# Altium project Radiation_Uni_Board.PrjPcb (part 1 of 2)
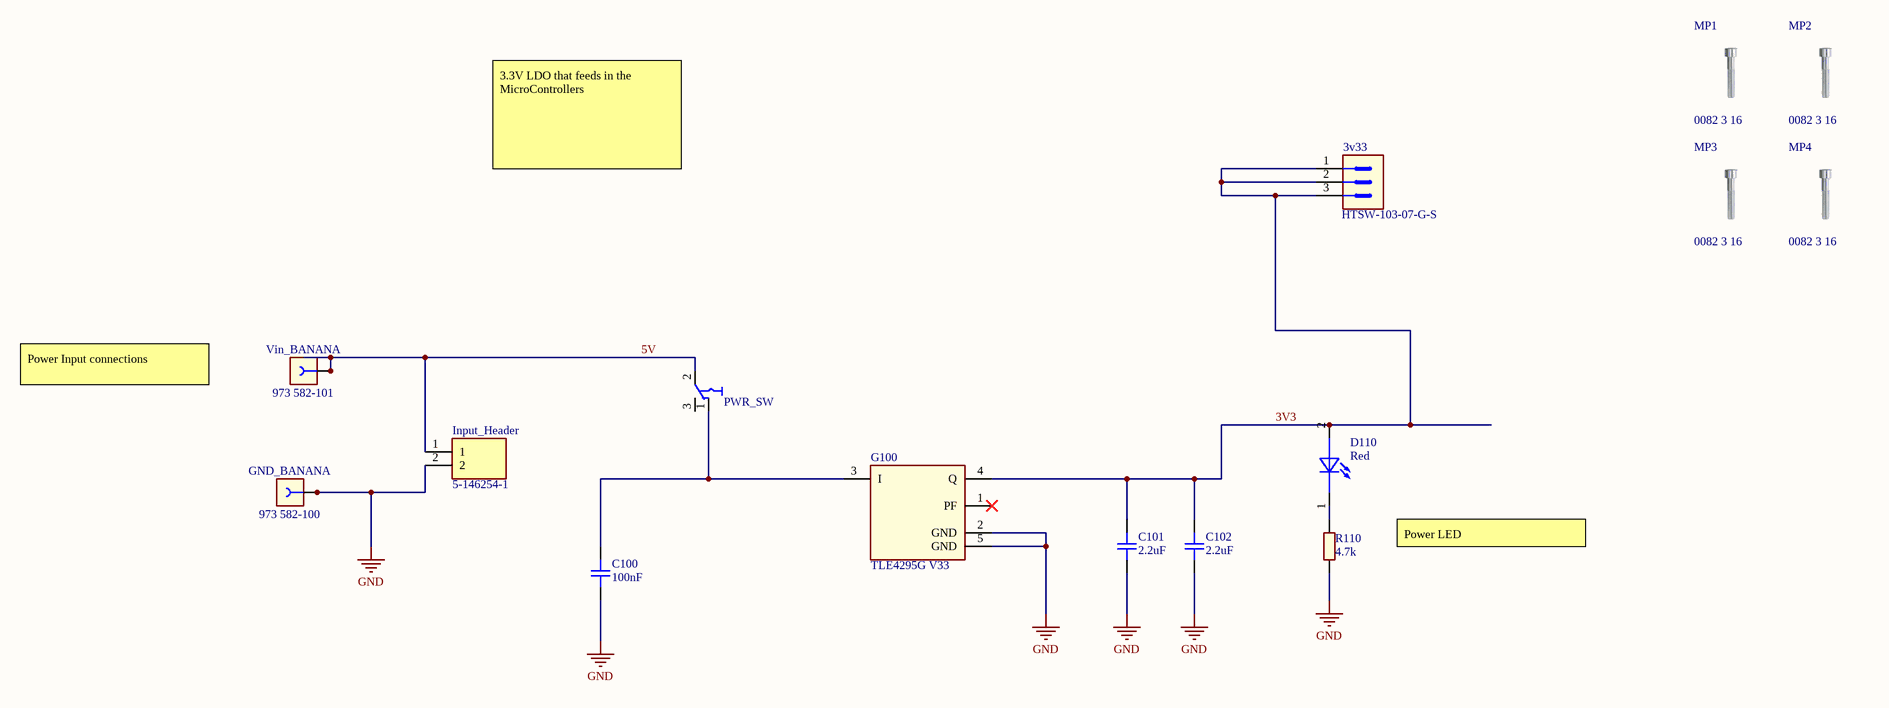
[diagram p0: PowerSupply.SchDoc]
PRJ_Address1: IFAG DES SDF SCS EPE; PRJ_Address2: Technical University of Munich; PRJ_Engineer: Youssef Tarkhan; PRJ_Organization: Infineon Technologies AG/TUM; PRJ_PCB_Revision: V1.0; PRJ_PCBDesigner: Youssef Tarkhan; PRJ_Responsible: Youssef Tarkhan; PRJ_SCH_Author: Youssef Tarkhan; PRJ_SCH_Revision: V1.0; PRJ_Title: MCU Radiation Testing Board; PRJ_Year: 2022; Variant: V1.0
3 sheets, 92 parts. Net scope: global (net labels, ports and power ports of the same name join across sheets).
Board file: Mainboard.PcbDoc
Sheets:
  PowerSupply.SchDoc
  STM32.SchDoc
  XMC4504.SchDoc

## Sheet PowerSupply.SchDoc: <Project Name>
size A3; ApprovedBy: <Appr.>; Author: <Author>; CompanyName: Infineon Technologies AG; Engineer: <Rel.>; Organization: Infineon Technologies AG; Address1: IFAG DES S PS; Address2: Am Campeon 1-12  -  85579 Neubiberg  -  Germany; Address3: 85579 Neubiberg; Address4: Germany; Revision: <Rev.>; SheetNumber: 1; SheetTotal: 3; Release: RC00; PageSetup: Record=PageOptions|CenterHorizontal=True|CenterVertical=True|PrintScale=1.01|XCorrection=1.00|YCorrection=1.00|PrintKind=0|BorderSize=5000000|LeftOffset=0|BottomOffset=0|Orientation=2|PaperLength=1000|PaperWidth=1000|Scale=100|PaperSource=7|PrintQuality=-4|MediaType=1|DitherType=10|PaperKind=A3|PrintScaleMode=1; Doc_ConfidentialStatus: <Doc_ConfidentialStatus>; Doc_Preliminary: <Doc_Preliminary>

### Parts
3v33  HTSW-103-07-G-S  [CON-THT-2.54-3-1-8.38]
C100  100nF  [CAPC1608X90N-2]
C101  2.2uF  [CAPC1608X90N-3]
C102  2.2uF  [CAPC1608X90N-3]
D110  Red  [LEDSC160X80X80-2N-1]
G100  TLE4295G V33  [IFX-PG-SCT595-5-2]
GND_BANANA  973 582-100  [CON-THT-973 582- 100]
Input_Header  5-146254-1  [HDRV2W68P254_2X1_213X488X1045P]
MP1  0082 3 16  [SCREW_0082 3 16_NPTH]
MP2  0082 3 16  [SCREW_0082 3 16_NPTH]
MP3  0082 3 16  [SCREW_0082 3 16_NPTH]
MP4  0082 3 16  [SCREW_0082 3 16_NPTH]
PWR_SW  CL-SB-12A-01T  [SW-SMD-CL-SB-12A-01T]  (value not drawn)
R110  4.7k  [RESC1609X55N]
Vin_BANANA  973 582-101  [CON-THT-973 582- 101]

### Nets
3V3: 3v33.1 3v33.2 3v33.3 C101.2 C102.2 D110.2(Anode) G100.4(Q)
GND: C100.1 C101.1 C102.1 G100.2(GND) G100.5(GND) GND_BANANA.1 GND_BANANA.2 Input_Header.2 R110.1  [project net VAGND]
5V: Input_Header.1 PWR_SW.2 Vin_BANANA.1 Vin_BANANA.2
NetC100_2: C100.2 G100.3(I) PWR_SW.1
NetD110_1: D110.1(Cathode) R110.2

Not connected (* = marked no-connect by the designer): G100 1(PF)*; PWR_SW 3

### Notes on the sheet
- 3.3V LDO that feeds in the MicroControllers
- Power Input connections
- Power LED
- Title
- Variant
- Approved
- Date:
- Author:
- Size:
- A3
- Document Name
- Time:
- SVN Revision:
- Rel.
- Rev.
- Sheet
- of

### Library data of the parts
3v33 = 375892: Through hole .025 SQ Post Header, 2.54mm pitch, 3 pin, vertical, single row; Legacy PartNumber: CON00000054; Manufacturer: Samtec; Article Number: 375892; Version Number: V01; Legacy DeviceID: SAM_HTSW-103-07-G-S; Combined Parameters: Board-to-Board Header (male);3x1;Mounting:THT;Orient:0° (vertical);Shielded:No; QuickPick: 0° (vertical) / Board-to-Board; Style: Strip; Automotive Qualified: No; ComponentStatus: Released; PLMStatus: Active; Second Source allowed: Yes; Voltage DC (max): na; Part Type: Connector; Manufacturer Order Number: HTSW-103-07-G-S; Value: HTSW-103-07-G-S; Type: Board-to-Board; Temperature min: -55; Temperature max: 125; Temperature Range: Military; ROHS Compliant: Y; ComponentLink1Description: Vendor WebSite; ComponentLink1URL: http://www.samtec.com/; ComponentLink2Description: Datasheet; ComponentLink2URL: http://webnetprod.muc.infineon.com/PCBPortal_Prod/WorkFlows/AltiumComponent/StandardDocumentation?Versionid=375893; Supplier 1: Farnell; Supplier Part Number 1: 1925743; Supplier 2: DigiKey; Supplier Part Number 2: SAM8814-ND; Supplier 3: Mouser; Package Description: Header,vertical,2.54mm pitch;0.64mm lead width,3 pins,1 row,3 pins per row,7.62mm L X 2.48mm W X 8.38mm H body
C100 = 479045: CAP / CERA / 100nF / 50V / 10% / X7R (EIA) / -55°C to 125°C / 0603 / SMD / -; Multiple Parts: No; Manufacturer: AVX; Manufacturer Order Number: 06035C104KAT2A; Symbol Type: Capacitor; Single; Standard; 2 Pins; Alternate View: Yes; Article Number: 479045; Version Number: V01; Combined Parameters: TC:X7R (EIA);Tol.:-10%/+10%;Vdc:50V; QuickPick: 100nF / 50V / 10% / X7R (EIA) / 0603; Type: Standard; Style: Single; ComponentStatus: Released; PLMStatus: Active; Part Type: Capacitor; Value: 100nF; Tolerance Neg: 10%; Tolerance Pos: 10%; Application: Standard; Technology: Ceramic; Temperature min: -55; Temperature max: 125; Temperature Range: Military; ROHS Compliant: Y; Automotive Qualified: No; PackageReference: 0603; ComponentLink1Description: Vendor WebSite; ComponentLink1URL: http://www.avx.com; ComponentLink2Description: Datasheet; ComponentLink2URL: http://webnetprod.muc.infineon.com/PCBPortal_Prod/WorkFlows/AltiumComponent/StandardDocumentation?Versionid=479046; Supplier 1: Farnell; Supplier Part Number 1: 2280883; Supplier 2: DigiKey; Supplier Part Number 2: 478-5052-2-ND; Supplier 3: Mouser; Supplier Part Number 3: 581-06035C104KAT2A; Second Source allowed: Yes; Voltage DC (max): 50V; Package Description: Capacitor,non-polarized,Chip;1.60mm L X 0.81mm W X 0.90mm H
C101 C102 = 310650: CAP / CERA / 2.2uF / 25V / 10% / X5R (EIA) / -55°C to 85°C / 0603(1608) / SMD / -; Multiple Parts: No; Legacy PartNumber: CAP01010924; Manufacturer: MuRata; Manufacturer Order Number: GRM188R61E225KA12D; Symbol Type: Capacitor; Single; Standard; 2 Pins; Alternate View: Yes; Article Number: 310650; Version Number: V01; Combined Parameters: TC:X5R (EIA);Tol.:-10%/+10%;Vdc:25V; QuickPick: 2.2uF / 25V / 10% / X5R (EIA) / 0603 (1608M); Type: Standard; Style: Single; Package Metric: 1608; Package Imperial: 0603; ComponentStatus: Released; PLMStatus: Active; Legacy DeviceID: CAP01010924; Part Type: Capacitor; Value: 2.2uF; Tolerance Neg: 10%; Tolerance Pos: 10%; Technology: Ceramic; Temperature min: -55; Temperature max: 85; Temperature Range: Military; ROHS Compliant: Y; Automotive Qualified: No; PackageReference: 0603 (1608M); ComponentLink1Description: Vendor WebSite; ComponentLink1URL: http://www.murata.com/; ComponentLink2Description: Datasheet; ComponentLink2URL: http://webnetprod.muc.infineon.com/PCBPortal_Prod/WorkFlows/AltiumComponent/StandardDocumentation?Versionid=310651; Supplier 1: Farnell; Supplier Part Number 1: 1845734RL; Supplier 2: DigiKey; Supplier Part Number 2: 490-10731-2-ND; Supplier 3: Mouser; Supplier Part Number 3: 81-GRM188R61E225KA2D; Second Source allowed: Yes; Voltage DC (max): 25V; Package Description: Capacitor,non-polarized,Chip;1.60mm L X 0.80mm W X 0.90mm H
D110 = 625459: WL-SMCW SMT Mono-color Chip LED Waterclear, Red,630nm; Manufacturer: Wurth Elektronik; Manufacturer Order Number: 150060RS75000; Symbol Type: Standard LED Symbol, 1 Cathode, 2 Anode; Article Number: 625459; Version Number: V01; Combined Parameters: Vf:2.4V;If:30mA;Ur:5V;Ir:10uA;Pmax:72mW; QuickPick: LED / 1608 (0603); Style: Single; Automotive Qualified: No; ComponentStatus: Released; PLMStatus: Active; Second Source allowed: Yes; Voltage DC (max): na; Part Type: Diode; Value: Red; Type: LED; Application: Standard; Temperature min: -40; Temperature max: 85; Temperature Range: Industrial; ROHS Compliant: Y; PackageReference: 1608 (0603); ComponentLink1Description: Vendor WebSite; ComponentLink1URL: http://www.we-online.com; ComponentLink2Description: Datasheet; ComponentLink2URL: http://webnetprod.muc.infineon.com/PCBPortal_Prod/WorkFlows/AltiumComponent/StandardDocumentation?Versionid=625460; Supplier 1: Farnell; Supplier Part Number 1: 2322071; Supplier 2: DigiKey; Supplier Part Number 2: 732-4978-1-ND; Supplier 3: Mouser; Supplier Part Number 3: 710-150060RS75000; Package Description: LED,Side Concave; 2 pin,1.60mm W X 0.80mm L X 0.80mm H
G100 = 617559: Multiple Parts: No; Manufacturer: Infineon Technologies; Symbol Type: 5-V Voltage Regulator; Article Number: 617559; Version Number: V01; Legacy DeviceID: IFX_TLE4295G V33; Combined Parameters: - - -;Vo:3.17V to 3.43V; QuickPick: PG-SCT595-5-2; Automotive Qualified: Yes; ComponentStatus: Released; PLMStatus: Active; Voltage DC (max): na; Alternate View: No; Part Type: Power Supply; Manufacturer Order Number: TLE4295G V33; Value: TLE4295G V33; Temperature min: -40; Temperature max: 150; Temperature Range: Automotive; ROHS Compliant: Y; PackageReference: PG-SCT595-5-2; ComponentLink1Description: Vendor WebSite; ComponentLink1URL: https://www.infineon.com/; ComponentLink2Description: Datasheet; ComponentLink2URL: http://webnetprod.muc.infineon.com/PCBPortal_Prod/WorkFlows/AltiumComponent/StandardDocumentation?Versionid=617560; Supplier 1: Farnell; Supplier Part Number 1: 2762385; Supplier 2: DigiKey; Supplier Part Number 2: 448-TLE4295GV33HTSA1CT-ND; Supplier 3: Mouser; Supplier Part Number 3: 726-TLE4295GV33HTSA1; Second Source allowed: Yes; Package Description: PG-SCT595-5-2; 5 pin, 1.60 mm L X 2.90 mm W X 1.1 mm H body
GND_BANANA = 377401: Banana Socket, black, 17.5mm Pitch; Legacy PartNumber: CON01500045; Manufacturer: Hirschmann Test & Measurement; Manufacturer Component Status: Active; Symbol Type: Banana Socket 2 Pins; Article Number: 377401; Version Number: V01; Legacy DeviceID: HTM_973 582- 100; Combined Parameters: Board-to-Cable Socket (female);-x-;Mounting:THT;Orient:90° (right angle);Shielded:No; QuickPick: 90° (right angle) / Board-to-Cable; Automotive Qualified: No; ComponentStatus: Released; Second Source allowed: Yes; Voltage DC (max): na; Part Type: Connector; Manufacturer Order Number: 973 582-100; Value: 973 582-100; Type: Board-to-Cable; Style: Banana; Temperature min: -25; Temperature max: 85; Temperature Range: Military; ROHS Compliant: N; ComponentLink1Description: Vendor WebSite; ComponentLink1URL: http://www.sks-kontakt.de/; ComponentLink2Description: Datasheet; ComponentLink2URL: http://webnetprod.muc.infineon.com/PCBPortal_Prod/WorkFlows/AltiumComponent/StandardDocumentation?Versionid=377402; Supplier 1: Farnell; Supplier Part Number 1: 497344; Supplier 2: DigiKey; Supplier 3: Mouser; Supplier Part Number 3: 845-973582100; PLMStatus: Active; Package Description: Banana Jack, 2 pins, 17.5mm Pitch, 21mm L X 7.5mm W X 10.5mm H body
Input_Header = 5-146254-1: Connector; Manufacturer_Name: TE Connectivity; Datasheet Link: https://www.te.com/commerce/DocumentDelivery/DDEController?Action=srchrtrv&DocNm=146254&DocType=Customer+Drawing&DocLang=English; Height: 10.45mm; Manufacturer_Part_Number: 5-146254-1
MP1-MP4 = 455343: Cheese Head Screw With Hexagon Socket, DIN 912 (ISO 4762), M3, 16mm length; Legacy PartNumber: MEC10000167; Manufacturer: Wurth Elektronik; Alternate View: No; Symbol Type: Cheese-Head Screw, M2.5X5-DIN 912; Article Number: 455343; Version Number: V01; Legacy DeviceID: MEC_0082 3 16; Combined Parameters: Steel Hexagonal 19x5.68 Screw; Style: Hexagonal; ComponentStatus: Released; PLMStatus: Active; Second Source allowed: Yes; Voltage DC (max): na; Multiple Parts: No; Part Type: Mechanical; Manufacturer Order Number: 0082 3 16; Value: 0082 3 16; QuickPick: Screw; Type: Screw; Temperature min: 0; Temperature max: 0; Temperature Range: Military; ROHS Compliant: N; Automotive Qualified: No; PackageReference: THT; ComponentLink1Description: Vendor WebSite; ComponentLink1URL: http://www.we-online.com; ComponentLink2Description: Datasheet; ComponentLink2URL: http://webnetprod.muc.infineon.com/PCBPortal_Prod/WorkFlows/AltiumComponent/StandardDocumentation?Versionid=455344; Supplier 1: Farnell; Supplier 2: DigiKey; Supplier 3: Mouser; Package Description: M3 Cheese Head Screw X 5.68mm Head
PWR_SW = 650099: Slid Switch, 12V, 200mA; Manufacturer: NIDEC COPAL ELECTRONICS, Inc.; Symbol Type: Switch, 2 Change Over 1 3, 3 Pins; Article Number: 650099; Version Number: V00; Automotive Qualified: No; ComponentStatus: Released; PLMStatus: Active; Second Source allowed: Yes; Voltage DC (max): na; Part Type: Electro Mechanic; Manufacturer Order Number: CL-SB-12A-01T; Value: CL-SB-12A-01T; Application: Power; Temperature min: -40; Temperature max: 85; Temperature Range: Industrial; ROHS Compliant: Y; ComponentLink1Description: Vendor WebSite; ComponentLink1URL: www.copal-electronics.com/; ComponentLink2Description: Datasheet; ComponentLink2URL: http://webnetprod.muc.infineon.com/PCBPortal_Prod/WorkFlows/AltiumComponent/StandardDocumentation?Versionid=650100; Supplier 1: Farnell; Supplier Part Number 1: 2854744; Supplier 2: DigiKey; Supplier Part Number 2: 563-1314-1-ND; Supplier 3: Mouser; Supplier Part Number 3: 229-CL-SB-12A-01T; Package Description: Switch, SMD, 3 Pins, 3.50 mm W X 8.50 mm L X 6.10 mm H body
R110 = 699381: RES / STD / 4.7k / 100mW / 1% / 100ppm/K / -55°C to 155°C / 1.60mm L X 0.85mm W X 0.55mm H / - / -; Multiple Parts: No; Manufacturer: Panasonic; Manufacturer Order Number: ERJ3EKF4701V; Symbol Type: Resistor; Single; Standard; 2 Pins; Alternate View: Yes; Article Number: 699381; Version Number: V00; Combined Parameters: TCR:100ppm/K;Tol.:-1%/+1%;Vdc:-;Idc:-;P:100mW; QuickPick: 4.7k / 1% / 0.1 / ERJ3EKF4701V; Style: Single; Automotive Qualified: AEC Q200; ComponentStatus: Released; PLMStatus: Active; Part Type: Resistor; Value: 4.7k; Tolerance Neg: 1%; Tolerance Pos: 1%; Type: Standard; Application: Standard; Technology: Thick Film; Temperature min: -55; Temperature max: 155; Temperature Range: Military; ROHS Compliant: Y; PackageReference: ERJ3EKF4701V; ComponentLink1Description: Vendor WebSite; ComponentLink1URL: http://panasonic.net/sanyo/index.html; ComponentLink2Description: Datasheet; ComponentLink2URL: http://webnetprod.muc.infineon.com/PCBPortal_Prod/WorkFlows/AltiumComponent/StandardDocumentation?Versionid=699382; Supplier 1: Farnell; Supplier Part Number 1: 2303181; Supplier 2: DigiKey; Supplier Part Number 2: P4.70KHCT-ND; Supplier 3: Mouser; Supplier Part Number 3: 667-ERJ-3EKF4701V; Second Source allowed: Yes; Package Description: Resistor,Chip;1.60mm L X 0.85mm W X 0.55mm H
Vin_BANANA = 377341: Banana Socket, Red, 17.5mm Pitch; Legacy PartNumber: CON01500041; Manufacturer: Hirschmann Test & Measurement; Manufacturer Component Status: Active; Symbol Type: Banana Socket 2 Pins; Article Number: 377341; Version Number: V01; Legacy DeviceID: HTM_973 582- 101; Combined Parameters: Board-to-Cable Socket (female);2x1;Mounting:THT;Orient:90° (right angle);Shielded:No; QuickPick: 90° (right angle) / Board-to-Cable; ComponentStatus: Released; Second Source allowed: Yes; Voltage DC (max): na; Part Type: Connector; Manufacturer Order Number: 973 582-101; Value: 973 582-101; Type: Board-to-Cable; Style: Banana; Temperature min: -25; Temperature max: 85; Temperature Range: Military; ROHS Compliant: N; ComponentLink1Description: Vendor WebSite; ComponentLink1URL: http://www.sks-kontakt.de/; ComponentLink2Description: Datasheet; ComponentLink2URL: http://webnetprod.muc.infineon.com/PCBPortal_Prod/WorkFlows/AltiumComponent/StandardDocumentation?Versionid=377342; Supplier 1: Farnell; Supplier Part Number 1: 497332; Supplier 2: DigiKey; Supplier 3: Mouser; Supplier Part Number 3: 845-973582101; PLMStatus: Active; Package Description: Banana Jack, 2 pins, 17.5mm Pitch, 21mm L X 7.5mm W X 10.5mm H body

## Sheet STM32.SchDoc: <Project Name>
size A3; ApprovedBy: <Appr.>; Author: <Author>; CompanyName: Infineon Technologies AG; Engineer: <Rel.>; Organization: Infineon Technologies AG; Address1: IFAG DES S PS; Address2: Am Campeon 1-12  -  85579 Neubiberg  -  Germany; Address3: 85579 Neubiberg; Address4: Germany; Revision: <Rev.>; SheetNumber: 2; SheetTotal: 3; Release: RC00; PageSetup: Record=PageOptions|CenterHorizontal=True|CenterVertical=True|PrintScale=1.01|XCorrection=1.00|YCorrection=1.00|PrintKind=0|BorderSize=5000000|LeftOffset=0|BottomOffset=0|Orientation=2|PaperLength=1000|PaperWidth=1000|Scale=100|PaperSource=7|PrintQuality=-4|MediaType=1|DitherType=10|PaperKind=A3|PrintScaleMode=1; Doc_ConfidentialStatus: <Doc_ConfidentialStatus>; Doc_Preliminary: <Doc_Preliminary>
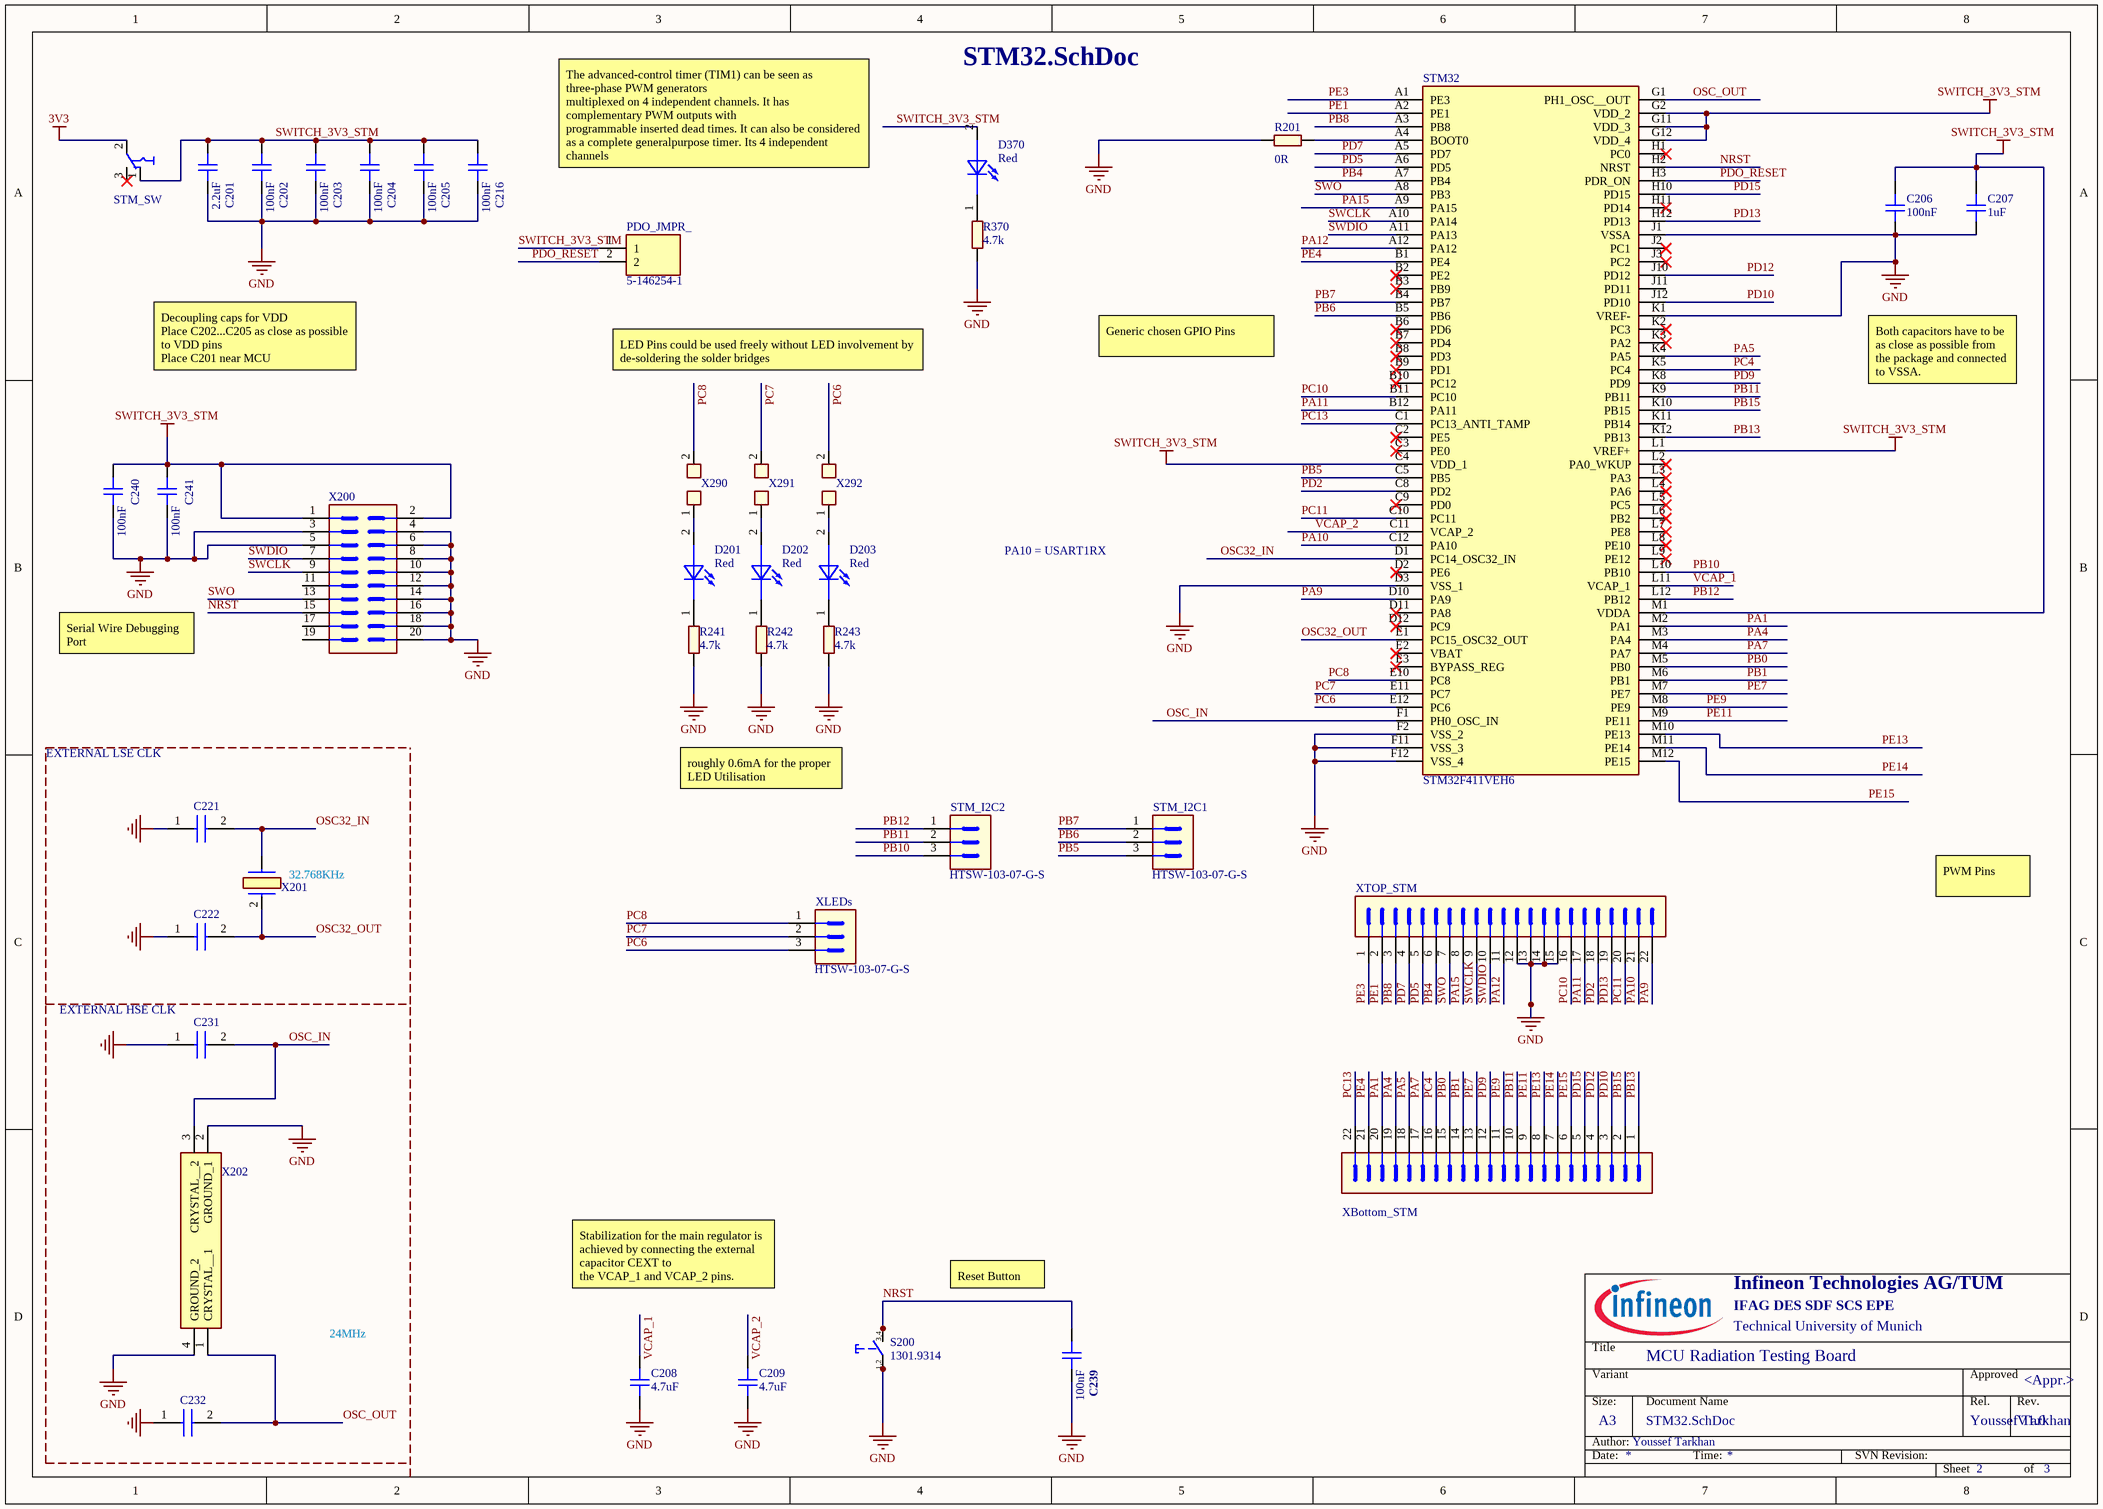
[diagram p1: STM32.SchDoc]

### Parts
C201  2.2uF  [CAPC1608X90N-3]
C202  100nF  [CAPC1608X90N-2]
C203  100nF  [CAPC1608X90N-2]
C204  100nF  [CAPC1608X90N-2]
C205  100nF  [CAPC1608X90N-2]
C206  100nF  [CAPC1608X90N-2]
C207  1uF  [CAPC1608X50N]
C208  4.7uF  [CAPC1608X95N]
C209  4.7uF  [CAPC1608X95N]
C216  100nF  [CAPC1608X90N-2]
C221  CC0402CRNPO9BN5R1  [CAPC1005X55N]  (value not drawn)
C222  CC0402CRNPO9BN5R1  [CAPC1005X55N]  (value not drawn)
C231  CC0603CRNPO9BN6R8  [CAPC1608X90N]  (value not drawn)
C232  CC0603CRNPO9BN6R8  [CAPC1608X90N]  (value not drawn)
C239  100nF  [CAPC1608X90N-2]
C240  100nF  [CAPC1608X90N-2]
C241  100nF  [CAPC1608X90N-2]
D201  Red  [LEDSC160X80X80-2N-1]
D202  Red  [LEDSC160X80X80-2N-1]
D203  Red  [LEDSC160X80X80-2N-1]
D370  Red  [LEDSC160X80X80-2N-1]
PDO_JMPR_  5-146254-1  [HDRV2W68P254_2X1_213X488X1045P]
R201  0R  [RESC1608X55N-1]
R241  4.7k  [RESC1609X55N]
R242  4.7k  [RESC1609X55N]
R243  4.7k  [RESC1609X55N]
R370  4.7k  [RESC1609X55N]
S200  1301.9314  [SW-SMD-1301.9314]
STM32  STM32F411VEH6  [BGA100C50P12X12_700X700X60]
STM_I2C1  HTSW-103-07-G-S  [CON-THT-2.54-3-1-8.38]
STM_I2C2  HTSW-103-07-G-S  [CON-THT-2.54-3-1-8.38]
STM_SW  CL-SB-12A-01T  [SW-SMD-CL-SB-12A-01T]  (value not drawn)
X200  827-22-020-10-003101  [CON-M-THT-827-22-020-10-003101]  (value not drawn)
X201  NX3215SA-32.768KHZ-EXS00A-MU00525  [NX3215SA32768KHZEXS00AMU00525]  (value not drawn)
X202  NX2016SA-24MHZ-EXS00A-CS10820  [NX2016SA24MHZEXS00ACS10820]  (value not drawn)
X290  Solder Jumper 2 Pins  [SOLDER_BRIDGE_0.7X1.299PAD]  (value not drawn)
X291  Solder Jumper 2 Pins  [SOLDER_BRIDGE_0.7X1.299PAD]  (value not drawn)
X292  Solder Jumper 2 Pins  [SOLDER_BRIDGE_0.7X1.299PAD]  (value not drawn)
XBottom_STM  TSW-122-07-L-S  [CON-M-THT-TSW-122-07-L-S]  (value not drawn)
XLEDs  HTSW-103-07-G-S  [CON-THT-2.54-3-1-8.38]
XTOP_STM  TSW-122-07-L-S  [CON-M-THT-TSW-122-07-L-S]  (value not drawn)

### Nets
3V3: STM_SW.2
GND: C201.1 C202.1 C203.1 C204.1 C205.1 C206.2 C207.1 C208.1 C209.1 C216.1 C221.1 C222.1 C231.1 C232.1 C239.1 C240.1 C241.1 R201.1 R241.1 R242.1 R243.1 R370.1 S200.1 S200.2 STM32.D3(VSS_1) STM32.F2(VSS_2) STM32.F11(VSS_3) STM32.F12(VSS_4) STM32.J1(VSSA) STM32.K1(VREF-) X200.3 X200.4 X200.5 X200.6 X200.8 X200.10 X200.12 X200.14 X200.16 X200.18 X200.20 X202.2(GROUND_1) X202.4(GROUND_2) XTOP_STM.12 XTOP_STM.13 XTOP_STM.14 XTOP_STM.15  [project net VAGND]
SWITCH_3V3_STM: C201.2 C202.2 C203.2 C204.2 C205.2 C206.1 C207.2 C216.2 C240.2 C241.2 D370.2(Anode) PDO_JMPR_.1 STM32.C4(VDD_1) STM32.G2(VDD_2) STM32.G11(VDD_3) STM32.G12(VDD_4) STM32.L1(VREF+) STM32.M1(VDDA) STM_SW.1 X200.1 X200.2
NRST: C239.2 S200.3 S200.4 STM32.H2(NRST) X200.15
OSC32_IN: C221.2 STM32.D1(PC14_OSC32_IN) X201.?1
OSC32_OUT: C222.2 STM32.E1(PC15_OSC32_OUT) X201.2(X2)
OSC_IN: C231.2 STM32.F1(PH0_OSC_IN) X202.3(CRYSTAL__2)
OSC_OUT: C232.2 STM32.G1(PH1_OSC__OUT) X202.1(CRYSTAL__1)
PA1: STM32.M2(PA1) XBottom_STM.20
PA4: STM32.M3(PA4) XBottom_STM.19
PA5: STM32.K4(PA5) XBottom_STM.18
PA7: STM32.M4(PA7) XBottom_STM.17
PA9: STM32.D10(PA9) XTOP_STM.22
PA10: STM32.C12(PA10) XTOP_STM.21
PA11: STM32.B12(PA11) XTOP_STM.17
PA12: STM32.A12(PA12) XTOP_STM.11
PA15: STM32.A9(PA15) XTOP_STM.8
PB0: STM32.M5(PB0) XBottom_STM.15
PB1: STM32.M6(PB1) XBottom_STM.14
PB4: STM32.A7(PB4) XTOP_STM.6
PB5: STM32.C5(PB5) STM_I2C1.3
PB6: STM32.B5(PB6) STM_I2C1.2
PB7: STM32.B4(PB7) STM_I2C1.1
PB8: STM32.A3(PB8) XTOP_STM.3
PB10: STM32.L10(PB10) STM_I2C2.3
PB11: STM32.K9(PB11) STM_I2C2.2 XBottom_STM.10
PB12: STM32.L12(PB12) STM_I2C2.1
PB13: STM32.K12(PB13) XBottom_STM.1
PB15: STM32.K10(PB15) XBottom_STM.2
PC4: STM32.K5(PC4) XBottom_STM.16
PC6: STM32.E12(PC6) X292.2 XLEDs.3
PC7: STM32.E11(PC7) X291.2 XLEDs.2
PC8: STM32.E10(PC8) X290.2 XLEDs.1
PC10: STM32.B11(PC10) XTOP_STM.16
PC11: STM32.C10(PC11) XTOP_STM.20
PC13: STM32.C1(PC13_ANTI_TAMP) XBottom_STM.22
PD2: STM32.C8(PD2) XTOP_STM.18
PD5: STM32.A6(PD5) XTOP_STM.5
PD7: STM32.A5(PD7) XTOP_STM.4
PD9: STM32.K8(PD9) XBottom_STM.12
PD10: STM32.J12(PD10) XBottom_STM.3
PD12: STM32.J10(PD12) XBottom_STM.4
PD13: STM32.H12(PD13) XTOP_STM.19
PD15: STM32.H10(PD15) XBottom_STM.5
PDO_RESET: PDO_JMPR_.2 STM32.H3(PDR_ON)
PE1: STM32.A2(PE1) XTOP_STM.2
PE3: STM32.A1(PE3) XTOP_STM.1
PE4: STM32.B1(PE4) XBottom_STM.21
PE7: STM32.M7(PE7) XBottom_STM.13
PE9: STM32.M8(PE9) XBottom_STM.11
PE11: STM32.M9(PE11) XBottom_STM.9
PE13: STM32.M10(PE13) XBottom_STM.8
PE14: STM32.M11(PE14) XBottom_STM.7
PE15: STM32.M12(PE15) XBottom_STM.6
SWCLK: STM32.A10(PA14) X200.9 XTOP_STM.9
SWDIO: STM32.A11(PA13) X200.7 XTOP_STM.10
SWO: STM32.A8(PB3) X200.13 XTOP_STM.7
VCAP_1: C208.2 STM32.L11(VCAP_1)
VCAP_2: C209.2 STM32.C11(VCAP_2)
NetD201_1: D201.1(Cathode) R241.2
NetD201_2: D201.2(Anode) X290.1
NetD202_1: D202.1(Cathode) R242.2
NetD202_2: D202.2(Anode) X291.1
NetD203_1: D203.1(Cathode) R243.2
NetD203_2: D203.2(Anode) X292.1
NetD370_1: D370.1(Cathode) R370.2
NetR201_2: R201.2 STM32.A4(BOOT0)

Not connected (* = marked no-connect by the designer): STM32 B2(PE2)* B3(PB9)* B6(PD6)* B7(PD4)* B8(PD3)* B9(PD1)* B10(PC12)* C2(PE5)* C3(PE0)* C9(PD0)* D2(PE6)* D11(PA8)* D12(PC9)* E2(VBAT)* E3(BYPASS_REG)* H1(PC0)* H11(PD14)* J2(PC1)* J3(PC2)* J11(PD11) K2(PC3)* K3(PA2)* K11(PB14) L2(PA0_WKUP)* L3(PA3)* L4(PA6)* L5(PC5)* L6(PB2)* L7(PE8)* L8(PE10)* L9(PE12)*; STM_SW 3*; X200 11 17 19

### Notes on the sheet
- The advanced-control timer (TIM1) can be seen as three-phase PWM generators
  multiplexed on 4 independent channels. It has complementary PWM outputs with
  programmable inserted dead times. It can also be considered as a complete generalpurpose timer. Its 4 independent channels
- Decoupling caps for VDD
  Place C202...C205 as close as possible to VDD pins
  Place C201 near MCU
- LED Pins could be used freely without LED involvement by de-soldering the solder bridges
- Generic chosen GPIO Pins
- Both capacitors have to be as close as possible from the package and connected to VSSA.
- PA10 = USART1RX
- Serial Wire Debugging Port
- EXTERNAL LSE CLK
- roughly 0.6mA for the proper LED Utilisation
- (near X201) 32.768KHz
- PWM Pins
- (near C231) EXTERNAL HSE CLK
- Stabilization for the main regulator is achieved by connecting the external capacitor CEXT to
  the VCAP_1 and VCAP_2 pins.
- Reset Button
- 24MHz
- Title
- Variant
- Approved
- Date:
- Author:
- Size:
- A3
- Document Name
- Time:
- SVN Revision:
- Rel.
- Rev.
- Sheet
- of
- (in symbol 380147) 3,4; 1,2

### Library data of the parts
C201 = 310650: as C101 on sheet PowerSupply; Legacy DeviceID: CAP01010924; Part Type: Capacitor; Value: 2.2uF; Tolerance Neg: 10%; Tolerance Pos: 10%; Technology: Ceramic; Temperature min: -55; Temperature max: 85; Temperature Range: Military; ROHS Compliant: Y; Automotive Qualified: No; PackageReference: 0603 (1608M); ComponentLink1Description: Vendor WebSite; ComponentLink1URL: http://www.murata.com/; ComponentLink2Description: Datasheet; ComponentLink2URL: http://webnetprod.muc.infineon.com/PCBPortal_Prod/WorkFlows/AltiumComponent/StandardDocumentation?Versionid=310651; Supplier 1: Farnell; Supplier Part Number 1: 1845734RL; Supplier 2: DigiKey; Supplier Part Number 2: 490-10731-2-ND; Supplier 3: Mouser; Supplier Part Number 3: 81-GRM188R61E225KA2D; Second Source allowed: Yes; Voltage DC (max): 25V; Package Description: Capacitor,non-polarized,Chip;1.60mm L X 0.80mm W X 0.90mm H
C202-C206 C216 C239-C241 = 479045: as C100 on sheet PowerSupply; Part Type: Capacitor; Value: 100nF; Tolerance Neg: 10%; Tolerance Pos: 10%; Application: Standard; Technology: Ceramic; Temperature min: -55; Temperature max: 125; Temperature Range: Military; ROHS Compliant: Y; Automotive Qualified: No; PackageReference: 0603; ComponentLink1Description: Vendor WebSite; ComponentLink1URL: http://www.avx.com; ComponentLink2Description: Datasheet; ComponentLink2URL: http://webnetprod.muc.infineon.com/PCBPortal_Prod/WorkFlows/AltiumComponent/StandardDocumentation?Versionid=479046; Supplier 1: Farnell; Supplier Part Number 1: 2280883; Supplier 2: DigiKey; Supplier Part Number 2: 478-5052-2-ND; Supplier 3: Mouser; Supplier Part Number 3: 581-06035C104KAT2A; Second Source allowed: Yes; Voltage DC (max): 50V; Package Description: Capacitor,non-polarized,Chip;1.60mm L X 0.81mm W X 0.90mm H
C207 = 267094: CAP / CERA / 1uF / 6.3V / 10% / X5R (EIA) / -55°C to 85°C / 0603(1608) / SMD / -; Multiple Parts: No; Legacy PartNumber: CAP01002425; Manufacturer: MuRata; Manufacturer Order Number: GRM185R60J105KE26; Symbol Type: Capacitor; Single; Standard; 2 Pins; Alternate View: Yes; Article Number: 267094; Version Number: V01; Combined Parameters: TC:X5R (EIA);Tol.:-10%/+10%;Vdc:6.3V; QuickPick: 1uF / 6.3V / 10% / X5R (EIA) / 0603 (1608); Type: Standard; Style: Single; Package Metric: 1608; Package Imperial: 0603; ComponentStatus: Released; PLMStatus: Not Recommended For New Designs; Legacy DeviceID: CAP01002425; Part Type: Capacitor; Value: 1uF; Tolerance Neg: 10%; Tolerance Pos: 10%; Application: Standard; Technology: Ceramic; Temperature min: -55; Temperature max: 85; Temperature Range: Military; ROHS Compliant: Y; Automotive Qualified: No; PackageReference: 0603 (1608); ComponentLink1Description: Vendor WebSite; ComponentLink1URL: http://www.murata.com/; ComponentLink2Description: Datasheet; ComponentLink2URL: http://webnetprod.muc.infineon.com/PCBPortal_Prod/WorkFlows/AltiumComponent/StandardDocumentation?Versionid=267095; Supplier 1: Farnell; Supplier 2: DigiKey; Supplier 3: Mouser; Second Source allowed: Yes; Voltage DC (max): 6.3V; Package Description: Capacitor,non-polarized,Chip;1.60mm L X 0.80mm W X 0.50mm H
C208 C209 = 308695: CAP / CERA / 4.7uF / 6.3V / 10% / X7R (EIA) / -55°C to 125°C / 0603(1608) / SMD / -; Multiple Parts: No; Legacy PartNumber: CAP01010671; Manufacturer: Samsung; Manufacturer Order Number: CL10B475KQ8NQNC; Symbol Type: Capacitor; Single; Standard; 2 Pins; Alternate View: Yes; Article Number: 308695; Version Number: V01; Combined Parameters: TC:X7R (EIA);Tol.:-10%/+10%;Vdc:6.3V; QuickPick: 4.7uF / 6.3V / 10% / X7R (EIA) / 0603 (1608); Type: Standard; Style: Single; Package Metric: 1608; Package Imperial: 0603; ComponentStatus: Released; PLMStatus: Active; Legacy DeviceID: CAP01010671; Part Type: Capacitor; Value: 4.7uF; Tolerance Neg: 10%; Tolerance Pos: 10%; Technology: Ceramic; Temperature min: -55; Temperature max: 125; Temperature Range: Military; ROHS Compliant: Y; Automotive Qualified: No; PackageReference: 0603 (1608); ComponentLink1Description: Vendor WebSite; ComponentLink1URL: http://www.samsungsem.co.kr/; ComponentLink2Description: Datasheet; ComponentLink2URL: http://webnetprod.muc.infineon.com/PCBPortal_Prod/WorkFlows/AltiumComponent/StandardDocumentation?Versionid=308696; Supplier 1: Farnell; Supplier 2: DigiKey; Supplier Part Number 2: 1276-2087-2-ND; Supplier 3: Mouser; Second Source allowed: Yes; Voltage DC (max): 6.3V; Package Description: Capacitor,non-polarized,Chip;1.60mm L X 0.80mm W X 0.95mm H
C221 C222 = CC0402CRNPO9BN5R1: Capacitor; Manufacturer_Name: KEMET; Datasheet Link: https://www.yageo.com/upload/media/product/productsearch/datasheet/mlcc/UPY-GP_NP0_16V-to-50V_18.pdf; Height: 0.55mm; Manufacturer_Part_Number: CC0402CRNPO9BN5R1
C231 C232 = CC0603CRNPO9BN6R8: Capacitor / 6.8pF; Manufacturer_Name: KEMET; Height: 0.9mm; Manufacturer_Part_Number: CC0603CRNPO9BN6R8
D201-D203 D370 = 625459: as D110 on sheet PowerSupply; Part Type: Diode; Value: Red; Type: LED; Application: Standard; Temperature min: -40; Temperature max: 85; Temperature Range: Industrial; ROHS Compliant: Y; PackageReference: 1608 (0603); ComponentLink1Description: Vendor WebSite; ComponentLink1URL: http://www.we-online.com; ComponentLink2Description: Datasheet; ComponentLink2URL: http://webnetprod.muc.infineon.com/PCBPortal_Prod/WorkFlows/AltiumComponent/StandardDocumentation?Versionid=625460; Supplier 1: Farnell; Supplier Part Number 1: 2322071; Supplier 2: DigiKey; Supplier Part Number 2: 732-4978-1-ND; Supplier 3: Mouser; Supplier Part Number 3: 710-150060RS75000; Package Description: LED,Side Concave; 2 pin,1.60mm W X 0.80mm L X 0.80mm H
PDO_JMPR_ = 5-146254-1: as Input_Header on sheet PowerSupply; Datasheet Link: https://www.te.com/commerce/DocumentDelivery/DDEController?Action=srchrtrv&DocNm=146254&DocType=Customer+Drawing&DocLang=English; Height: 10.45mm; Manufacturer_Part_Number: 5-146254-1
R201 = 328011: RES / STD / 0R / 100mW / 0R / 0ppm/K / -55°C to 155°C / 0603(1608) / SMD / -; Multiple Parts: No; Legacy PartNumber: RES00000126; Manufacturer: Yageo; Manufacturer Order Number: RC0603JR-070RL; Symbol Type: Resistor; Single; Standard; 2 Pins; Alternate View: Yes; Article Number: 328011; Version Number: V01; Combined Parameters: TCR:0ppm/K;Tol.:-0R/+0R;Vdc:75V;Idc:1A;P:100mW; QuickPick: 0R / 0R / 0.1 / 0603 (1608); Style: Single; Package Metric: 1608; Package Imperial: 0603; ComponentStatus: Released; PLMStatus: Active; Voltage DC (max): 75V; Legacy DeviceID: RES00000126; Part Type: Resistor; Value: 0R; Tolerance Neg: 0R; Tolerance Pos: 0R; Type: Standard; Technology: Thick Film; Temperature min: -55; Temperature max: 155; Temperature Range: Military; ROHS Compliant: Y; Automotive Qualified: No; PackageReference: 0603 (1608); ComponentLink1Description: Vendor WebSite; ComponentLink1URL: http://www.yageo.com/; ComponentLink2Description: Datasheet; ComponentLink2URL: http://webnetprod.muc.infineon.com/PCBPortal_Prod/WorkFlows/AltiumComponent/StandardDocumentation?Versionid=328012; Supplier 1: Farnell; Supplier Part Number 1: 9233130; Supplier 2: DigiKey; Supplier Part Number 2: 311-0.0GRTR-ND; Supplier 3: Mouser; Supplier Part Number 3: 603-RC0603JR-070RL; Second Source allowed: Yes
R241-R243 R370 = 699381: as R110 on sheet PowerSupply; Part Type: Resistor; Value: 4.7k; Tolerance Neg: 1%; Tolerance Pos: 1%; Type: Standard; Application: Standard; Technology: Thick Film; Temperature min: -55; Temperature max: 155; Temperature Range: Military; ROHS Compliant: Y; PackageReference: ERJ3EKF4701V; ComponentLink1Description: Vendor WebSite; ComponentLink1URL: http://panasonic.net/sanyo/index.html; ComponentLink2Description: Datasheet; ComponentLink2URL: http://webnetprod.muc.infineon.com/PCBPortal_Prod/WorkFlows/AltiumComponent/StandardDocumentation?Versionid=699382; Supplier 1: Farnell; Supplier Part Number 1: 2303181; Supplier 2: DigiKey; Supplier Part Number 2: P4.70KHCT-ND; Supplier 3: Mouser; Supplier Part Number 3: 667-ERJ-3EKF4701V; Second Source allowed: Yes; Package Description: Resistor,Chip;1.60mm L X 0.85mm W X 0.55mm H
S200 = 380147: Pushbutton Tactile Switch, Single Pole Single Throw, 4 Pins; Legacy PartNumber: CON01500305; Manufacturer: Schurter; Symbol type: Tactile Switch, Spring Return, Single Pole Single Throw - Normally Open, 4 Pins; Article Number: 380147; Version Number: V01; Legacy DeviceID: SCH_1301.9314; ComponentStatus: Released; PLMStatus: Active; Second Source allowed: Yes; Voltage DC (max): na; Part Type: Electro Mechanic; Manufacturer Order Number: 1301.9314; Value: 1301.9314; Temperature min: -20; Temperature max: 70; Temperature Range: Commercial; ROHS Compliant: Y; ComponentLink1Description: Vendor WebSite; ComponentLink1URL: http://www.schurter.com.sg/; ComponentLink2Description: Datasheet; ComponentLink2URL: http://webnetprod.muc.infineon.com/PCBPortal_Prod/WorkFlows/AltiumComponent/StandardDocumentation?Versionid=380148; Supplier 1: Farnell; Supplier Part Number 1: 1217763; Supplier 2: DigiKey; Supplier Part Number 2: 1301.9314-ND; Supplier 3: Mouser; Supplier Part Number 3: 693-1301.9314; Package Description: SMD Switch, 6.00mm L X 6.00mm W X 4.3mm H body
STM32 = STM32F411VEH6: Integrated Circuit; Manufacturer_Name: STMicroelectronics; Datasheet Link: https://www.st.com/resource/en/datasheet/stm32f411ve.pdf; Height: 0.6mm; Manufacturer_Part_Number: STM32F411VEH6
STM_I2C1 STM_I2C2 XLEDs = 375892: as 3v33 on sheet PowerSupply; Part Type: Connector; Manufacturer Order Number: HTSW-103-07-G-S; Value: HTSW-103-07-G-S; Type: Board-to-Board; Temperature min: -55; Temperature max: 125; Temperature Range: Military; ROHS Compliant: Y; ComponentLink1Description: Vendor WebSite; ComponentLink1URL: http://www.samtec.com/; ComponentLink2Description: Datasheet; ComponentLink2URL: http://webnetprod.muc.infineon.com/PCBPortal_Prod/WorkFlows/AltiumComponent/StandardDocumentation?Versionid=375893; Supplier 1: Farnell; Supplier Part Number 1: 1925743; Supplier 2: DigiKey; Supplier Part Number 2: SAM8814-ND; Supplier 3: Mouser; Package Description: Header,vertical,2.54mm pitch;0.64mm lead width,3 pins,1 row,3 pins per row,7.62mm L X 2.48mm W X 8.38mm H body
STM_SW = 650099: as PWR_SW on sheet PowerSupply; Part Type: Electro Mechanic; Manufacturer Order Number: CL-SB-12A-01T; Value: CL-SB-12A-01T; Application: Power; Temperature min: -40; Temperature max: 85; Temperature Range: Industrial; ROHS Compliant: Y; ComponentLink1Description: Vendor WebSite; ComponentLink1URL: www.copal-electronics.com/; ComponentLink2Description: Datasheet; ComponentLink2URL: http://webnetprod.muc.infineon.com/PCBPortal_Prod/WorkFlows/AltiumComponent/StandardDocumentation?Versionid=650100; Supplier 1: Farnell; Supplier Part Number 1: 2854744; Supplier 2: DigiKey; Supplier Part Number 2: 563-1314-1-ND; Supplier 3: Mouser; Supplier Part Number 3: 229-CL-SB-12A-01T; Package Description: Switch, SMD, 3 Pins, 3.50 mm W X 8.50 mm L X 6.10 mm H body
X200 = 602795: Spring Piston Connector Through Hole, 20 positions; Manufacturer: Mill-Max; Article Number: 602795; Version Number: V01; Legacy DeviceID: MIL_827-22-020-10-003101; Combined Parameters: Board-to-Cable Header (male);10x2;Mounting:THT;Orient:0° (vertical);Shielded:No; QuickPick: 0° (vertical) / Board-to-Cable; Style: Strip; Automotive Qualified: No; ComponentStatus: Released; PLMStatus: Active; Second Source allowed: Yes; Voltage DC (max): na; Symbol Type: Header 10x2; Part Type: Connector; Manufacturer Order Number: 827-22-020-10-003101; Value: 827-22-020-10-003101; Type: Board-to-Cable; Application: Standard Interface; Temperature min: 0; Temperature max: 0; Temperature Range: Military; ROHS Compliant: Y; PackageReference: THT; ComponentLink1Description: Vendor WebSite; ComponentLink1URL: http://www.mill-max.com/; ComponentLink2Description: Datasheet; ComponentLink2URL: http://webnetprod.muc.infineon.com/PCBPortal_Prod/WorkFlows/AltiumComponent/StandardDocumentation?Versionid=602796; Supplier 1: Farnell; Supplier 2: DigiKey; Supplier Part Number 2: ED1406-ND; Supplier 3: Mouser; Supplier Part Number 3: 575-8272202010003101; Package Description: Header, THT, 2.54 mm Pitch; 20 pin, 2 rows, 10 pins per row, 5.08 mm L X 25.4 mm W X 9.19mm H body
X201 = NX3215SA-32.768KHZ-EXS00A-MU00525: Crystal or Oscillator; Manufacturer_Name: NDK; Datasheet Link: https://www.ndk.com/en/products/search/crystal/1188854_1494.html; Height: 0.9mm; Manufacturer_Part_Number: NX3215SA-32.768KHZ-EXS00A-MU00525
X202 = NX2016SA-24MHZ-EXS00A-CS10820: Crystal or Oscillator; Manufacturer_Name: NDK; Datasheet Link: https://www.ndk.com/images/products/catalog/c_NX2016SA-2_e.pdf; Height: 0.5mm; Manufacturer_Part_Number: NX2016SA-24MHZ-EXS00A-CS10820
X290-X292 = 433601: Multiple Parts: No; Legacy PartNumber: CON01500959; Manufacturer: Infineon Technologies; Alternate View: Yes; Article Number: 433601; Version Number: V01; Legacy DeviceID: IFX_Solder Jumper 2 Pins; Combined Parameters: - None (onboard);2x1;Mounting:SMT;Orient:None (onboard);Shielded:No; QuickPick: None (onboard); Style: Not Applicable; ComponentStatus: Released; PLMStatus: Active; Voltage DC (max): na; Symbol Type: Solder Jumper 2 Pins; Part Type: Connector; Manufacturer Order Number: Solder Jumper 2 Pins; Value: Solder Jumper 2 Pins; Temperature min: 0; Temperature max: 0; Temperature Range: Military; ROHS Compliant: N; Automotive Qualified: No; ComponentLink1Description: Vendor WebSite; ComponentLink1URL: https://www.infineon.com/; ComponentLink2Description: Datasheet; Supplier 1: Farnell; Supplier 2: DigiKey; Supplier 3: Mouser; Second Source allowed: Yes; Package Description: Solder Bridge 2 Pins, 0.7X1.299mm Pad, 1.6mm L X 1.2mm W body
XBottom_STM XTOP_STM = 385945: Through hole .025 SQ Post Header, 2.54mm pitch, 22 pin, vertical, single row; Legacy PartNumber: CON01500868; Manufacturer: Samtec; Symbol type: Header 22pins; Article Number: 385945; Version Number: V01; Legacy DeviceID: SAM_TSW-122-07-L-S; Combined Parameters: Board-to-Board/Cable Header (male);22x1;Mounting:THT;Orient:0° (vertical);Shielded:No; QuickPick: 0° (vertical) / Board-to-Board/Cable; Style: Strip; Automotive Qualified: No; ComponentStatus: Released; PLMStatus: Active; Second Source allowed: Yes; Voltage DC (max): na; Part Type: Connector; Manufacturer Order Number: TSW-122-07-L-S; Value: TSW-122-07-L-S; Type: Board-to-Board/Cable; Temperature min: -55; Temperature max: 125; Temperature Range: Military; ROHS Compliant: Y; ComponentLink1Description: Vendor WebSite; ComponentLink1URL: http://www.samtec.com/; ComponentLink2Description: Datasheet; ComponentLink2URL: http://webnetprod.muc.infineon.com/PCBPortal_Prod/WorkFlows/AltiumComponent/StandardDocumentation?Versionid=385946; Supplier 1: Farnell; Supplier Part Number 1: 2035626; Supplier 2: DigiKey; Supplier Part Number 2: SAM1031-22-ND; Supplier 3: Mouser; Package Description: Header, Vertical, 2.54mm pitch; 0.64mm lead width, 22 pins, Single row, 55.88mm L X 2.54mm W X 8.712mm H body